# Altium schematic sheet GL3520 4 Ports.SchDoc
size A3
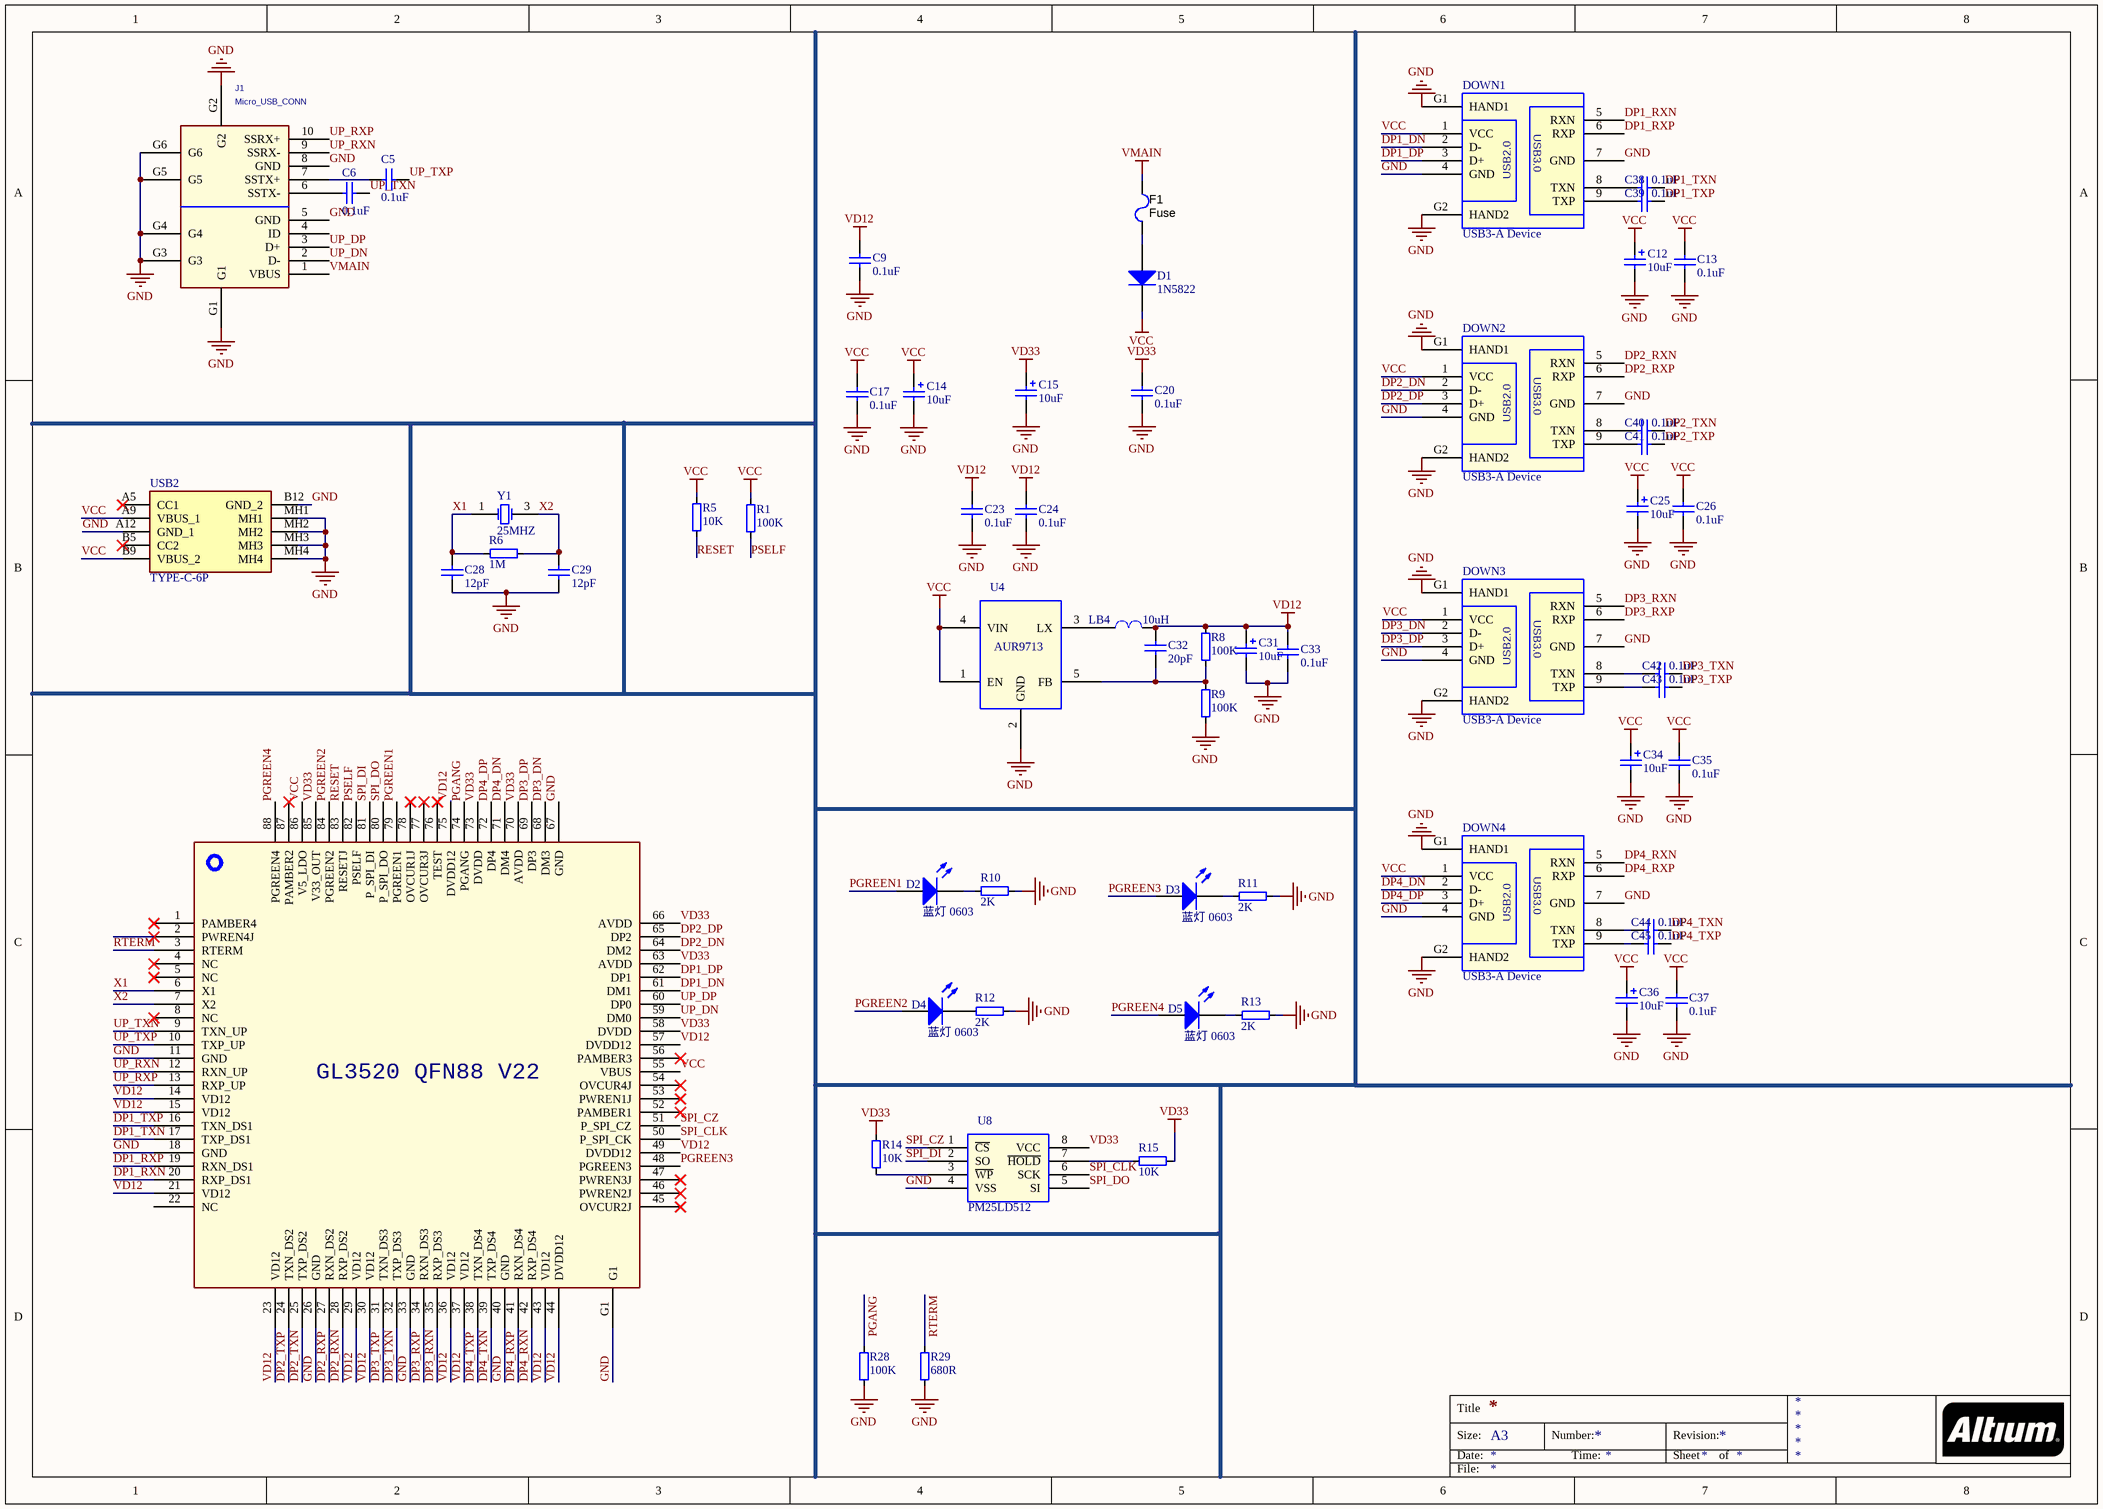
[diagram p0: GL3520 4 Ports.SchDoc]

## Parts
C5  0.1uF  [C 0603_L]
C6  0.1uF  [C 0603_L]
C9  0.1uF  [C 0603_L]
C12  10uF  [CASE-A_3216]
C13  0.1uF  [C 0603_L]
C14  10uF  [CASE-A_3216]
C15  10uF  [CASE-A_3216]
C17  0.1uF  [C 0603_L]
C20  0.1uF  [C 0603_L]
C23  0.1uF  [C 0603_L]
C24  0.1uF  [C 0603_L]
C25  10uF  [CASE-A_3216]
C26  0.1uF  [C 0603_L]
C28  12pF  [C 0603_L]
C29  12pF  [C 0603_L]
C31  10uF  [CASE-A_3216]
C32  20pF  [C 0603_L]
C33  0.1uF  [C 0603_L]
C34  10uF  [CASE-A_3216]
C35  0.1uF  [C 0603_L]
C36  10uF  [CASE-A_3216]
C37  0.1uF  [C 0603_L]
C38  0.1uF  [C 0603_L]
C39  0.1uF  [C 0603_L]
C40  0.1uF  [C 0603_L]
C41  0.1uF  [C 0603_L]
C42  0.1uF  [C 0603_L]
C43  0.1uF  [C 0603_L]
C44  0.1uF  [C 0603_L]
C45  0.1uF  [C 0603_L]
D1  1N5822  [SMA]
D2  蓝灯 0603  [0603_LED_S1]
D3  蓝灯 0603  [0603_LED_S1]
D4  蓝灯 0603  [0603_LED_S1]
D5  蓝灯 0603  [0603_LED_S1]
DOWN1  USB3-A Device  [USB3.0-2 - duplicate]
DOWN2  USB3-A Device  [USB3.0-2 - duplicate]
DOWN3  USB3-A Device  [USB3.0-2 - duplicate]
DOWN4  USB3-A Device  [USB3.0-2 - duplicate]
F1  Fuse  [FU 1206]
J1  Micro_USB_CONN  [MicroUSB-B-S_D]
LB4  10uH  [CD43]
R1  100K  [R 0603_L]
R5  10K  [R 0603_L]
R6  1M  [R 0603_L]
R8  100K  [R 0603_L]
R9  100K  [R 0603_L]
R10  2K  [R 0603_L]
R11  2K  [R 0603_L]
R12  2K  [R 0603_L]
R13  2K  [R 0603_L]
R14  10K  [R 0603_L]
R15  10K  [R 0603_L]
R28  100K  [R 0603_L]
R29  680R  [R 0603_L]
U4  AUR9713  [SOT23-5L]
U6  GL3520_QFN88_V094-1_22  [QFN88]  (value not drawn)
U8  PM25LD512  [SOP8_M]
USB2  TYPE-C-6P  [TYPE-C-SMD_TYPE-C-31-M-16 - duplicate]
Y1  25MHZ  [OSC 3225-4P]

## Nets
GND: C9.1 C12.2 C13.1 C14.2 C15.2 C17.1 C20.1 C23.1 C24.1 C25.2 C26.1 C28.1 C29.1 C31.2 C33.1 C34.2 C35.1 C36.2 C37.1 DOWN1.4(GND) DOWN1.7(GND) DOWN1.G1(HAND1) DOWN1.G2(HAND2) DOWN2.4(GND) DOWN2.7(GND) DOWN2.G1(HAND1) DOWN2.G2(HAND2) DOWN3.4(GND) DOWN3.7(GND) DOWN3.G1(HAND1) DOWN3.G2(HAND2) DOWN4.4(GND) DOWN4.7(GND) DOWN4.G1(HAND1) DOWN4.G2(HAND2) J1.5(GND) J1.8(GND) J1.G1 J1.G2 J1.G3 J1.G4 J1.G5 J1.G6 R9.2 R10.1 R11.1 R12.1 R13.1 R28.2 R29.2 U4.2(GND) U6.11(GND) U6.18(GND) U6.26(GND) U6.33(GND) U6.40(GND) U6.67(GND) U6.G1 U8.4(VSS) USB2.A12(GND_1) USB2.B12(GND_2) USB2.MH1 USB2.MH2 USB2.MH3 USB2.MH4
VCC: C12.1 C13.2 C14.1 C17.2 C25.1 C26.2 C34.1 C35.2 C36.1 C37.2 D1.2(K) DOWN1.1(VCC) DOWN2.1(VCC) DOWN3.1(VCC) DOWN4.1(VCC) R1.1 R5.2 U4.1(EN) U4.4(VIN) U6.55(VBUS) U6.86(V5_LDO) USB2.A9(VBUS_1) USB2.B9(VBUS_2)
VD12: C9.2 C23.2 C24.2 C31.1 C32.2 C33.2 LB4.2 R8.1 U6.14(VD12) U6.15(VD12) U6.21(VD12) U6.23(VD12) U6.29(VD12) U6.30(VD12) U6.36(VD12) U6.37(VD12) U6.43(VD12) U6.44(DVDD12) U6.49(DVDD12) U6.57(DVDD12) U6.75(DVDD12)
VD33: C15.1 C20.2 R14.1 R15.2 U6.58(DVDD) U6.63(AVDD) U6.66(AVDD) U6.70(AVDD) U6.73(DVDD) U6.85(V33_OUT) U8.8(VCC)
VMAIN: F1.1 J1.1(VBUS)
DP1_DN: DOWN1.2(D-) U6.61(DM1)
DP1_DP: DOWN1.3(D+) U6.62(DP1)
DP1_RXN: DOWN1.5(RXN) U6.20(RXP_DS1)
DP1_RXP: DOWN1.6(RXP) U6.19(RXN_DS1)
DP1_TXN: C38.1 U6.17(TXP_DS1)
DP1_TXP: C39.1 U6.16(TXN_DS1)
DP2_DN: DOWN2.2(D-) U6.64(DM2)
DP2_DP: DOWN2.3(D+) U6.65(DP2)
DP2_RXN: DOWN2.5(RXN) U6.28(RXP_DS2)
DP2_RXP: DOWN2.6(RXP) U6.27(RXN_DS2)
DP2_TXN: C40.1 U6.25(TXP_DS2)
DP2_TXP: C41.1 U6.24(TXN_DS2)
DP3_DN: DOWN3.2(D-) U6.68(DM3)
DP3_DP: DOWN3.3(D+) U6.69(DP3)
DP3_RXN: DOWN3.5(RXN) U6.35(RXP_DS3)
DP3_RXP: DOWN3.6(RXP) U6.34(RXN_DS3)
DP3_TXN: C42.1 U6.32(TXP_DS3)
DP3_TXP: C43.1 U6.31(TXN_DS3)
DP4_DN: DOWN4.2(D-) U6.71(DM4)
DP4_DP: DOWN4.3(D+) U6.72(DP4)
DP4_RXN: DOWN4.5(RXN) U6.42(RXP_DS4)
DP4_RXP: DOWN4.6(RXP) U6.41(RXN_DS4)
DP4_TXN: C44.1 U6.39(TXP_DS4)
DP4_TXP: C45.1 U6.38(TXN_DS4)
PGANG: R28.1 U6.74(PGANG)
PGREEN1: D2.A U6.79(PGREEN1)
PGREEN2: D4.A U6.84(PGREEN2)
PGREEN3: D3.A U6.48(PGREEN3)
PGREEN4: D5.A U6.88(PGREEN4)
PSELF: R1.2 U6.82(PSELF)
RESET: R5.1 U6.83(RESETJ)
RTERM: R29.1 U6.3(RTERM)
SPI_CLK: U6.50(P_SPI_CK) U8.6(SCK)
SPI_CZ: U6.51(P_SPI_CZ) U8.1(~{CS})
SPI_DI: U6.81(P_SPI_DI) U8.2(SO)
SPI_DO: U6.80(P_SPI_DO) U8.5(SI)
UP_DN: J1.2(D-) U6.59(DM0)
UP_DP: J1.3(D+) U6.60(DP0)
UP_RXN: J1.9(SSRX-) U6.12(RXN_UP)
UP_RXP: J1.10(SSRX+) U6.13(RXP_UP)
UP_TXN: C6.1 U6.9(TXN_UP)
UP_TXP: C5.1 U6.10(TXP_UP)
X1: C28.2 R6.1 U6.6(X1) Y1.1(OSC1)
X2: C29.2 R6.2 U6.7(X2) Y1.3(OSC2)
NetC5_2: C5.2 J1.7(SSTX+)
NetC6_2: C6.2 J1.6(SSTX-)
NetC32_1: C32.1 R8.2 R9.1 U4.5(FB)
NetC38_2: C38.2 DOWN1.8(TXN)
NetC39_2: C39.2 DOWN1.9(TXP)
NetC40_2: C40.2 DOWN2.8(TXN)
NetC41_2: C41.2 DOWN2.9(TXP)
NetC42_2: C42.2 DOWN3.8(TXN)
NetC43_2: C43.2 DOWN3.9(TXP)
NetC44_2: C44.2 DOWN4.8(TXN)
NetC45_2: C45.2 DOWN4.9(TXP)
NetD1_1: D1.1(A) F1.2
NetD2_K: D2.K R10.2
NetD3_K: D3.K R11.2
NetD4_K: D4.K R12.2
NetD5_K: D5.K R13.2
NetLB4_1: LB4.1 U4.3(LX)
NetR14_2: R14.2 U8.3(~{WP})
NetR15_1: R15.1 U8.7(~{HOLD})

Not connected (* = marked no-connect by the designer): J1 4(ID); U6 1(PAMBER4)* 2(PWREN4J)* 4(NC)* 5(NC)* 8(NC)* 22(NC) 45(OVCUR2J)* 46(PWREN2J)* 47(PWREN3J)* 52(PAMBER1)* 53(PWREN1J)* 54(OVCUR4J)* 56(PAMBER3)* 76(TEST)* 77(OVCUR3J)* 78(OVCUR1J)* 87(PAMBER2)*; USB2 A5(CC1)* B5(CC2)*

## Notes on the sheet
- Title
- Size:
- Date:
- A3
- Number:
- Time:
- Revision:
- Sheet
- of
- File:
- (in symbol GL3520_QFN88_V094-1_22) GL3520 QFN88 V22
- (in symbol USB3-A_5) USB3.0; USB2.0

## Library data of the parts
C5 C6 C9 C13 C17 C20 C23 C24 C26 C28 C29 C32 C33 C35 C37-C45 = 0603 2.2uF (225) 10% 16V: 贴片电容; ComponentLink1Description: 供应商链接; ComponentLink1URL: http://www.szlcsc.com/product/details_24366.html; Package: 0603; Supplier: LC; SuppliersPartNumber: C23630
C12 C25 C31 C34 C36 = 3216 10uF (106) 10% 16V: 钽电容; ComponentLink1Description: 供应商链接; ComponentLink1URL: http://www.szlcsc.com/product/details_7643.html; Package: 3216; Supplier: LC; SuppliersPartNumber: C7171
C14 C15 = 3216 10uF (106) 10% 16V: 钽电容1206; ComponentLink1Description: 供应商链接; ComponentLink1URL: http://www.szlcsc.com/product/details_7643.html; Package: 3216; Supplier: LC; SuppliersPartNumber: C7171
D1 = Diode 1N5400: 3 Amp General Purpose Rectifier; Published: 8-Jun-2000; LatestRevisionDate: 17-Jul-2002; LatestRevisionNote: Re-released for DXP Platform.; DatasheetVersion: 1998; PackageVersion: Aug-1999; PackageReference: DO-201AD; Publisher: Altium Limited; PackageDescription: Diode, Axial; Body 9.5 x 5.6 mm (LxDia. max), Lead Dia. 1.32 mm (max); ComponentLink1Description: Manufacturer Link; ComponentLink1URL: http://www.fairchildsemi.com/; ComponentLink2Description: Datasheet; ComponentLink2URL: http://www.fairchildsemi.com/ds/1N%2F1N5400.pdf
D2-D5 = 0603 蓝灯: 发光二极管; ComponentLink1Description: 供应商链接; ComponentLink1URL: http://www.szlcsc.com/product/details_73150.html; Package: 0603; Supplier: LC; SuppliersPartNumber: C72041
DOWN1-DOWN4 = USB3-A_5: PCB Footprint: CND-USB3A-A
F1 = Fuse: PartNumber: NANOSMDC020F-2; Manufacturer: TE Connectivity; VDC_V: 24; Rtyp_Ohm: 1.875; SymbolCreator: a0412235; SymbolVersion: 2013-04-02; PackageReference: 1206; MountType: SMT; CompType: Fuse; RoHS: Y; Published: 2009-03-05; Publisher: Texas Instruments; LatestRevisionDate: 2015-11-23; ComponentLink1Description: Datasheet URL; ComponentLink1URL: http://www.te.com/commerce/DocumentDelivery/DDEController?Action=srchrtrv&DocNm=SCD25536&DocType=Customer+Drawing&DocLang=English; Supplier 1: Digi-Key; Supplier Part Number 1: NANOSMDC020F-2CT-ND; Supplier 2: Mouser; Supplier Part Number 2: 650-NANOSMDC020F-2; Supplier 3: Farnell; Supplier Part Number 3: 1345939
J1 = USB-UEB11123-2JK1-4H_0: QUAN: 0; Qualify: YES; Dsc8: FOXCONN; Dsc7: BLUE; Dsc6: DIP; Dsc5: RIGHT ANGLE; Dsc4: 9PIN; Dsc3: UEB1112C-2AK1-4H; Dsc2: SINGLE B TYPE USB 3.0; Dsc1: CONN USB; approval status: PL; 弧: CONN USB SINGLE B TYPE USB 3.0; ID: 19328; Date: 02042009; Cost: 2.45; Part Type: DIP CONN
LB4 = L-0603: PCB Footprint: LBS-0603
R1 R5 R6 R8-R15 R28 R29 = RES
U4 = AUR9705_3: PCB Footprint: I-TSOT23-5P-2_9x1_6x0_95A
U8 = CAT25C128/256: PCB Footprint: I-SOP8-1_27A
USB2 = TYPE-C-31-M-17: Connector; Manufacturer_Name: Korean Hroparts Elec; Datasheet Link: https://datasheet.lcsc.com/szlcsc/1903211732_Korean-Hroparts-Elec-TYPE-C-31-M-17_C283540.pdf; Height: 3.26mm; Manufacturer_Part_Number: TYPE-C-31-M-17; Arrow Part Number: TYPE-C-31-M-17
Y1 = SMD-3225_4P  25MHZ 12PF 10PPM: 贴片晶振; ComponentLink1Description: 供应商链接; ComponentLink1URL: http://www.szlcsc.com/product/details_9526.html; Package: SMD-3225_4P; Supplier: LC; SuppliersPartNumber: C9006